# EAGLE design fb_DEV_1_lagig (EAGLE 5.04)
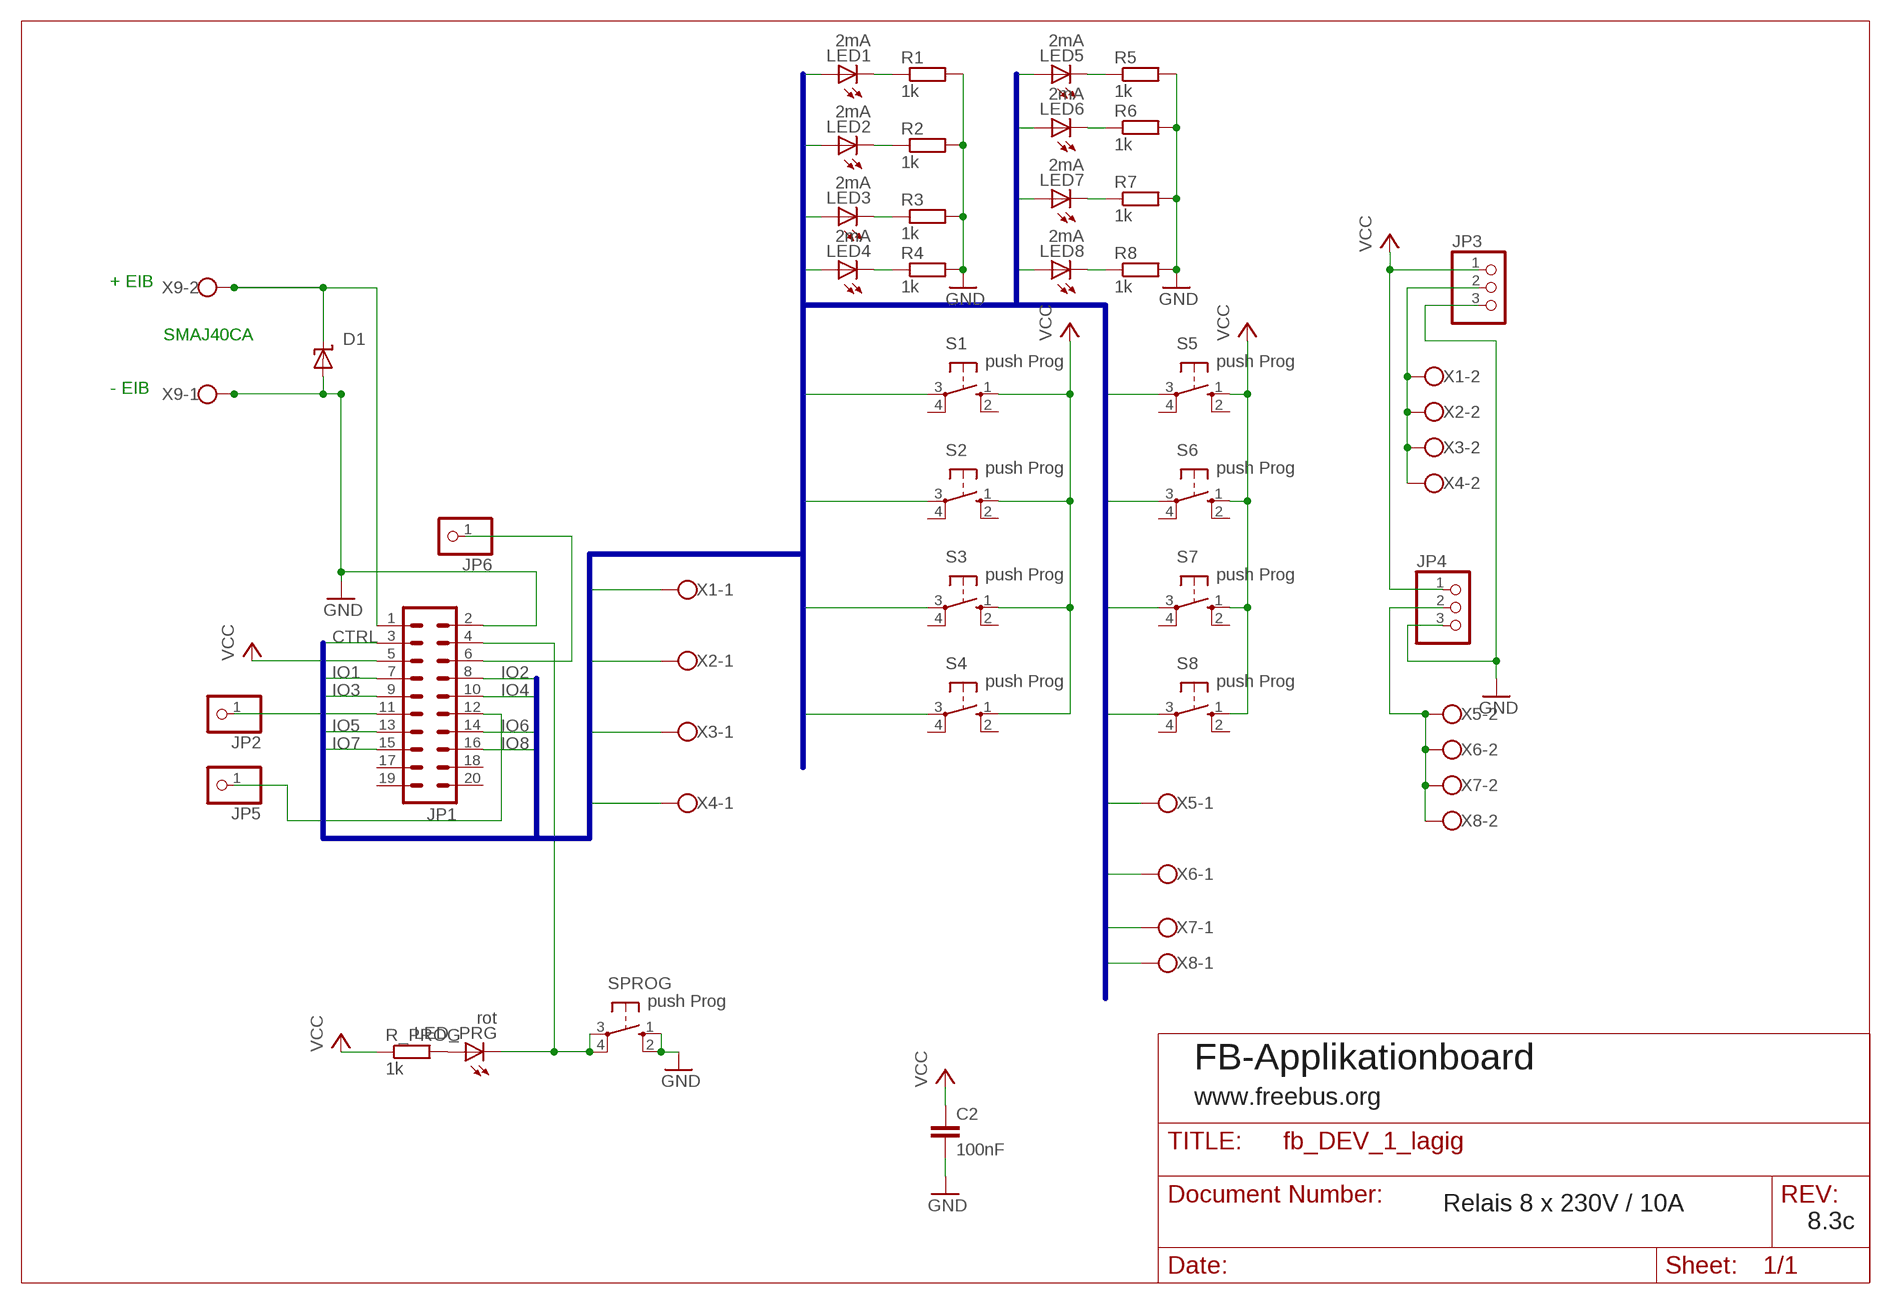
[diagram p0: schematic, sheet 1]

## Parts
C2  100nF  C-EU050-024X044  [C050-024X044]
D1  SUPPRESSOR-SMBJ  [SMBJ]
JP1  ML20  [ML20]
JP2  PINHD-1X1  [1X01]
JP3  PINHD-1X3  [1X03]
JP4  PINHD-1X3  [1X03]
JP5  PINHD-1X1  [1X01]
JP6  PINHD-1X1  [1X01]
LED1  2mA  LED3MM  [LED3MM]
LED2  2mA  LED3MM  [LED3MM]
LED3  2mA  LED3MM  [LED3MM]
LED4  2mA  LED3MM  [LED3MM]
LED5  2mA  LED3MM  [LED3MM]
LED6  2mA  LED3MM  [LED3MM]
LED7  2mA  LED3MM  [LED3MM]
LED8  2mA  LED3MM  [LED3MM]
LED_PRG  rot  LED3MM  [LED3MM]
R1  1k  R-EU_0207/10  [0207/10]
R2  1k  R-EU_0207/10  [0207/10]
R3  1k  R-EU_0207/10  [0207/10]
R4  1k  R-EU_0207/10  [0207/10]
R5  1k  R-EU_0207/10  [0207/10]
R6  1k  R-EU_0207/10  [0207/10]
R7  1k  R-EU_0207/10  [0207/10]
R8  1k  R-EU_0207/10  [0207/10]
R_PROG  1k  R-EU_0207/10  [0207/10]
S1  push Prog  10-XX  [B3F-10XX]
S2  push Prog  10-XX  [B3F-10XX]
S3  push Prog  10-XX  [B3F-10XX]
S4  push Prog  10-XX  [B3F-10XX]
S5  push Prog  10-XX  [B3F-10XX]
S6  push Prog  10-XX  [B3F-10XX]
S7  push Prog  10-XX  [B3F-10XX]
S8  push Prog  10-XX  [B3F-10XX]
SPROG  push Prog  10-XX  [B3F-10XX]
X1  W237-102  [W237-102]
X2  W237-102  [W237-102]
X3  W237-102  [W237-102]
X4  W237-102  [W237-102]
X5  W237-102  [W237-102]
X6  W237-102  [W237-102]
X7  W237-102  [W237-102]
X8  W237-102  [W237-102]
X9  W237-102  [W237-102]

## Nets
CTRL: JP1.3
GND: C2.2 D1.A JP1.2 JP3.3 JP4.3 R1.2 R2.2 R3.2 R4.2 R5.2 R6.2 R7.2 R8.2 SPROG.1(S) SPROG.2(S1) X9.1
IO1: JP1.7 LED1.A S1.3(P) X1.1
IO2: JP1.8 LED2.A S2.3(P) X2.1
IO3: JP1.9 LED3.A S3.3(P) X3.1
IO4: JP1.10 LED4.A S4.3(P) X4.1
IO5: JP1.13 LED5.A S5.3(P) X5.1
IO6: JP1.14 LED6.A S6.3(P) X6.1
IO7: JP1.15 LED7.A S7.3(P) X7.1
IO8: JP1.16 LED8.A S8.3(P) X8.1
N$1: JP4.2 X5.2 X6.2 X7.2 X8.2
N$2: JP3.2 X1.2 X2.2 X3.2 X4.2
N$3: LED1.K(C) R1.1
N$4: LED2.K(C) R2.1
N$5: LED3.K(C) R3.1
N$6: LED4.K(C) R4.1
N$7: JP1.11 JP2.1
N$8: JP1.12 JP5.1
N$9: LED5.K(C) R5.1
N$11: LED6.K(C) R6.1
N$12: LED7.K(C) R7.1
N$13: LED8.K(C) R8.1
N$20: D1.C JP1.1 X9.2
N$24: JP1.6 JP6.1
N$27: JP1.4 LED_PRG.K(C) SPROG.3(P) SPROG.4(P1)
N$28: LED_PRG.A R_PROG.2
VCC: C2.1 JP1.5 JP3.1 JP4.1 R_PROG.1 S1.1(S) S2.1(S) S3.1(S) S4.1(S) S5.1(S) S6.1(S) S7.1(S) S8.1(S)
Unconnected: JP1.17 JP1.18 JP1.19 JP1.20 S1.2(S1) S1.4(P1) S2.2(S1) S2.4(P1) S3.2(S1) S3.4(P1) S4.2(S1) S4.4(P1) S5.2(S1) S5.4(P1) S6.2(S1) S6.4(P1) S7.2(S1) S7.4(P1) S8.2(S1) S8.4(P1)

## Buses
IO[1..8],CTRL

## Notes on the sheet
- + EIB
- SMAJ40CA
- - EIB
- FB-Applikationboard
- www.freebus.org
- Relais 8 x 230V / 10A
- 8.3c

## Library data of the parts
C2 = rcl:C-EU: CAPACITOR, European symbol
D1 = diode:SUPPRESSOR-: Suppressor diode
JP1 = con-harting-ml:ML20: HARTING
JP2 JP5 JP6 = pinhead:PINHD-1X1: PIN HEADER
JP3 JP4 = pinhead:PINHD-1X3: PIN HEADER
LED1-LED8 LED_PRG = led:LED: LED OSRAM: - CHIPLED LG R971, LG N971, LY N971, LG Q971, LY Q971, LO R971, LY R971 LH N974, LH R974 LS Q976, LO Q976, LY Q976 LO Q996 - Hyper CHIPLED LW Q18S LB Q993, LB Q99A, LB R99A - SideLED LS A670, LO A670, LY A670, LG A670, LP A670 LB A673, LV A673, LT A673, LW A673 LH A674 LY A675 LS A676, LA A676, LO A676, LY A676, LW A676 LS A679, LY A679, LG A679 - Hyper Micro SIDELED® LS Y876, LA Y876, LO Y876, LY Y876 LT Y87S - SmartLED LW L88C, LW L88S LB L89C, LB L89S, LG L890 LS L89K, LO L89K, LY L89K LS L896, LA L896, LO L896, LY L896 - TOPLED LS T670, LO T670, LY T670, LG T670, LP T670 LSG T670, LSP T670, LSY T670, LOP T670, LYG T670 LG T671, LOG T671, LSG T671 LB T673, LV T673, LT T673, LW T673 LH T674 LS T676, LA T676, LO T676, LY T676, LB T676, LH T676, LSB T676, LW T676 LB T67C, LV T67C, LT T67C, LS T67K, LO T67K, LY T67K, LW E67C LS E67B, LA E67B, LO E67B, LY E67B, LB E67C, LV E67C, LT E67C LW T67C LS T679, LY T679, LG T679 LS T770, LO T770, LY T770, LG T770, LP T770 LB T773, LV T773, LT T773, LW T773 LH T774 LS E675, LA E675, LY E675, LS T675 LS T776, LA T776, LO T776, LY T776, LB T776 LHGB T686 LT T68C, LB T68C - Hyper Mini TOPLED® LB M676 - Mini TOPLED Santana® LG M470 LS M47K, LO M47K, LY M47K Source: http://www.osram.convergy.de - LUMILED® LXK2-PW12-R00, LXK2-PW12-S00, LXK2-PW14-U00, LXK2-PW14-V00 LXK2-PM12-R00, LXK2-PM12-S00, LXK2-PM14-U00 LXK2-PE12-Q00, LXK2-PE12-R00, LXK2-PE12-S00, LXK2-PE14-T00, LXK2-PE14-U00 LXK2-PB12-K00, LXK2-PB12-L00, LXK2-PB12-M00, LXK2-PB14-N00, LXK2-PB14-P00, LXK2-PB14-Q00 LXK2-PR12-L00, LXK2-PR12-M00, LXK2-PR14-Q00, LXK2-PR14-R00 LXK2-PD12-Q00, LXK2-PD12-R00, LXK2-PD12-S00 LXK2-PH12-R00, LXK2-PH12-S00 LXK2-PL12-P00, LXK2-PL12-Q00, LXK2-PL12-R00 Source: www.luxeon.com
R1-R8 R_PROG = rcl:R-EU_: RESISTOR, European symbol
S1-S8 SPROG = switch-omron:10-XX: OMRON SWITCH
X1-X9 = con-wago-500:W237-102: WAGO SCREW CLAMP

## Net classes
0 SELV: width 0.406 mm
1 230Vac: width 1.93 mm, clearance 5.08 mm to class 0, clearance 1.905 mm

## Board
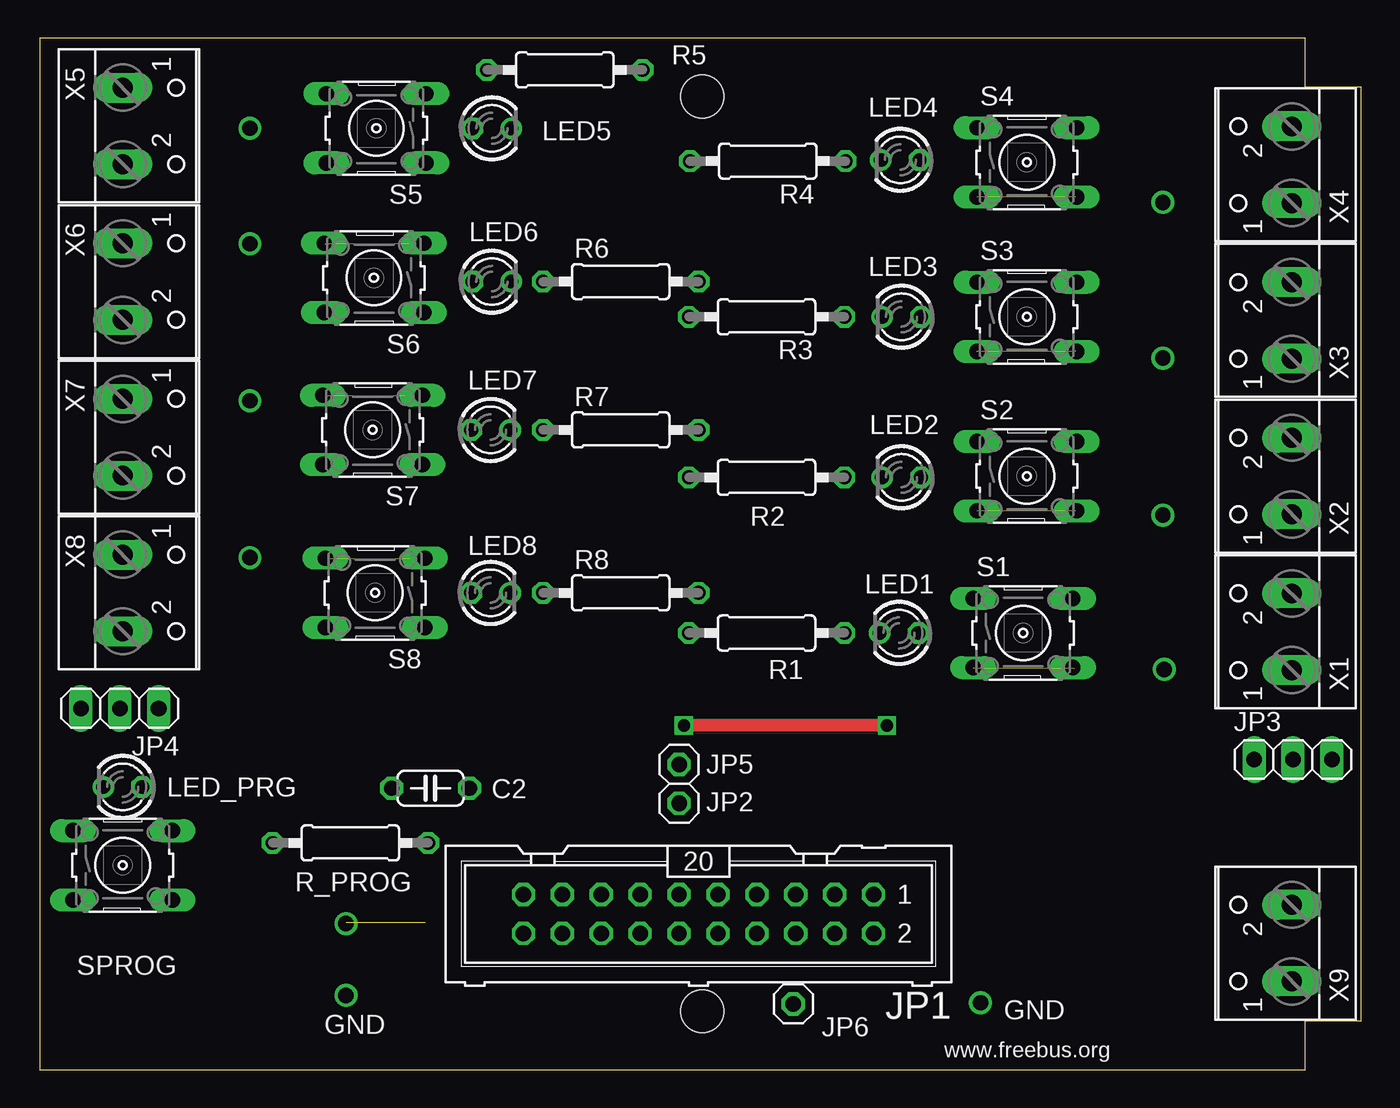
[diagram p1: board, top side]
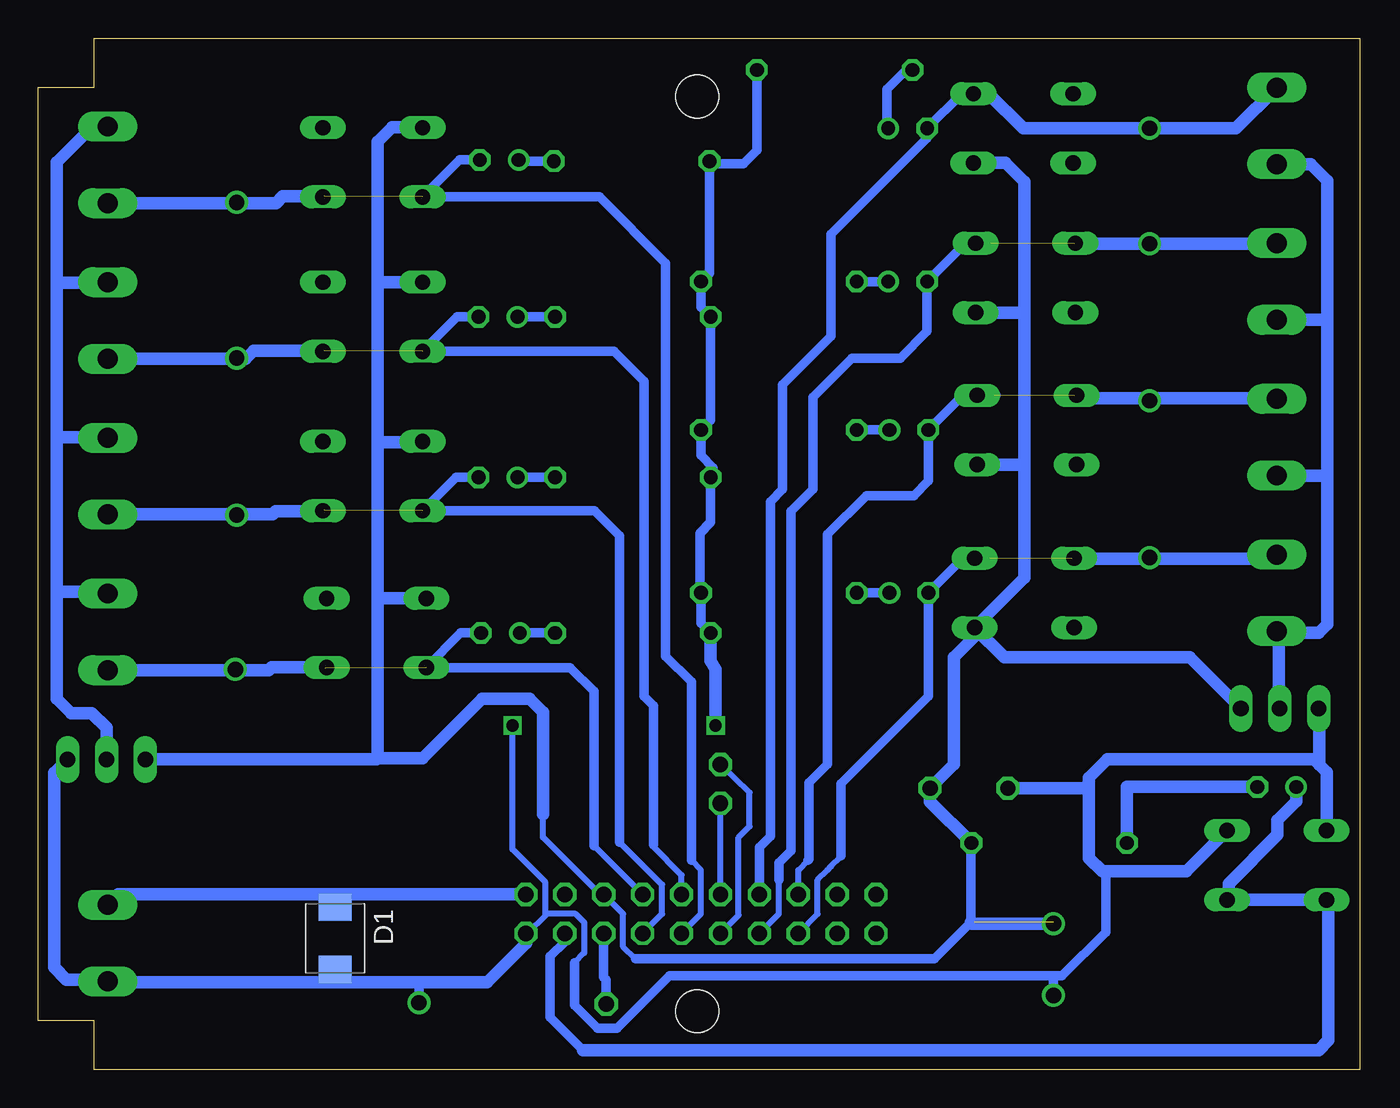
[diagram p2: board, bottom side, seen from below]

Size 86.28 x 67.31 mm. Coordinates in mm from the lower left corner, seen from the top.
Outline: 0,0.01 82.64,0 82.64,3.18 86.28,3.18 86.28,64.13 82.64,64.13 82.64,67.31 0,67.31 0,0.01
Copper layers (1*16): Top 0.035mm / dielectric 1.5mm / Bottom 0.035mm
Design rules "0.35mm": minimum track width 10mil, minimum drill 24mil, track to track 0.35mm, track to pad 0.35mm, pad to pad 0.35mm, via to via 0.35mm, smd to smd 0.35mm, copper to edge 0mil, drill to drill 8mil, minimum pad ring 10mil, minimum via ring 8mil, stop-mask expansion 4mil, vias tented up to drill 0mil, thermal gap 10mil
Holes 2.8 mm at 43.27,3.81 43.27,63.5

### Footprints (pad centres in the part's own frame; a part is rotated, then mirrored left to right if it is on the bottom)
C050-024X044 = drill 1 octagon: 1 -2.54,0; 2 2.54,0
SMBJ = smd 1.78 x 2.16: A 2.04,0; C -2.03,0
ML20 = drill 1 octagon: 1 -11.43,-1.27; 2 -11.43,1.27; 3 -8.89,-1.27; 4 -8.89,1.27; 5 -6.35,-1.27; 6 -6.35,1.27; 7 -3.81,-1.27; 8 -3.81,1.27; 9 -1.27,-1.27; 10 -1.27,1.27; 11 1.27,-1.27; 12 1.27,1.27; 13 3.81,-1.27; 14 3.81,1.27; 15 6.35,-1.27; 16 6.35,1.27; 17 8.89,-1.27; 18 8.89,1.27; 19 11.43,-1.27; 20 11.43,1.27
1X01 = drill 1.016 octagon: 1 0,0
1X03 = drill 1.016 long: 1 -2.54,0; 2 0,0; 3 2.54,0
LED3MM = drill 0.9 octagon: A -1.27,0 | drill 0.9 round: K 1.27,0
0207/10 = drill 0.9 octagon: 1 -5.08,0; 2 5.08,0
B3F-10XX = drill 1 long: 1 -3.251,2.261; 2 3.251,2.261; 3 -3.251,-2.261; 4 3.251,-2.261
W237-102 = drill 1.3 long: 1 -2.5,-1.27; 2 2.5,-1.27

### Placement (x,y rotation side)
C2  25.52,18.37 180 top
D1  66.91,8.57 270 bottom
JP1  43.01,10.16 180 top
JP2  41.74,17.38 0 top
JP3  81.83,20.24 0 top
JP4  5.23,23.57 180 top
JP5  41.75,19.92 0 top
JP6  49.21,4.29 0 top
LED1  56.11,28.5 180 top
LED2  56.27,38.66 180 top
LED3  56.27,49.13 180 top
LED4  56.19,59.37 180 top
LED5  29.52,61.44 0 top
LED6  29.52,51.44 0 top
LED7  29.44,41.75 0 top
LED8  29.44,31.11 0 top
LED_PRG  5.42,18.45 180 top
R1  47.46,28.5 180 top
R2  47.46,38.66 180 top
R3  47.46,49.13 180 top
R4  47.54,59.29 180 top
R5  34.28,65.25 0 top
R6  37.93,51.44 0 top
R7  37.93,41.75 0 top
R8  37.93,31.12 0 top
R_PROG  20.28,14.8 180 top
S1  64.21,28.5 0 top
S2  64.45,38.73 0 top
S3  64.45,49.13 0 top
S4  64.45,59.21 0 top
S5  21.98,61.44 180 top
S6  21.82,51.67 180 top
S7  21.74,41.75 180 top
S8  21.9,31.11 180 top
SPROG  5.42,13.34 0 top
X1  80.48,28.57 90 top
X2  80.48,38.73 90 top
X3  80.48,48.9 90 top
X4  80.48,59.05 90 top
X5  6.69,61.59 270 top
X6  6.69,51.44 270 top
X7  6.69,41.27 270 top
X8  6.69,31.11 270 top
X9  80.48,8.26 90 top

### Tracks (layer width: path | path; a pad name or v marks a point on that pad's centre or on a via)
GND  (via drill 0.8, 1)
  Top 0.813: v55.32,22.46 v42.06,22.46
  Bottom 0.406: JP1.2 54.37,8.89 53.17,10.08 | 53.17,10.08 53.17,12.22 55.32,14.37 v55.32,22.46 | 16.42,12.94 16.58,12.78 | 53.17,10.08 53.1,10.16 51.19,10.16 50.63,9.6 50.63,7.62 51.27,6.99
  Bottom 0.61: R5.2 39.36,60.01 40.24,59.13 42.3,59.13 R4.2 42.46,51.99 R6.2 43.01,49.77 R3.2 42.38,42.39 R7.2 43.01,40.08 42.22,39.29 42.22,38.81 R2.2 42.38,35.72 43.09,35 43.09,31.2 R8.2 43.01,29.13 R1.2 | 19.92,6.11 19.44,6.11 16.58,8.97 16.58,12.78 | 19.92,6.11 45.08,6.11 48.49,2.7 49.76,2.7 51.27,4.21 51.27,6.99 | v61.43,4.37 61.43,5.64 61.51,5.71 | v20,4.84 20,6.03 19.92,6.11
  Bottom 0.813: JP1.2 54.44,8.26 56.98,5.71 61.51,5.71 66.75,5.71 | 66.75,5.71 81.71,5.71 X9.1 81.87,5.87 84.45,5.87 85.24,6.67 85.24,19.37 JP3.3 | D1.A 66.91,5.87 66.75,5.71 | SPROG.1 2.17,19.4 2.65,19.88 | 2.65,19.88 3.01,20.24 16.48,20.24 17.68,19.04 17.68,18.65 | SPROG.2 11.33,12.94 16.42,12.94 16.82,12.94 17.68,13.8 17.68,18.65 | JP4.3 2.65,23.54 2.65,19.88 | C2.2 17.97,18.37 17.68,18.65 | R1.2 42.38,26.67 42.06,26.11 42.06,24.77 v42.06,22.46
IO1  (1 unrouted)
  Bottom 0.406: JP1.7 50,14.61
  Bottom 0.61: LED1.A 58.7,28.5 S1.3 51.55,26.23 50,24.69 50,14.61
  Bottom 0.813: X1.1 71.23,26.07 71.03,26.27 67.62,26.27 67.54,26.19
IO2  (1 unrouted)
  Bottom 0.406: JP1.8 45.55,10.16 45.55,12.06 47.46,13.97 47.62,14.13 48.33,14.84
  Bottom 0.61: LED2.A 59.01,38.66 S2.3 49.96,36.47 48.33,34.85 48.33,14.84
  Bottom 0.813: X2.1 70.99,36.23 70.8,36.43 67.7,36.43 67.62,36.51
IO3  (1 unrouted)
  Bottom 0.406: JP1.9 44.28,12.7 46.19,14.61 46.11,14.68
  Bottom 0.61: LED3.A 58.93,49.13 S3.3 48.69,46.87 46.75,44.93 46.75,24.37 46.11,23.73 46.11,14.68
  Bottom 0.813: X3.1 72.74,46.4 72.22,46.91 67.62,46.91
IO4  (1 unrouted)
  Bottom 0.406: JP1.10 43.01,10.16 43.01,13.02 43.65,13.65
  Bottom 0.61: LED4.A 58.78,59.37 S4.3 49.64,56.95 45.32,52.63 45.32,26.99 43.65,25.32 43.65,13.65
  Bottom 0.813: X4.1 70.76,56.55 70.32,56.99 67.62,56.99
IO5  (via drill 1)
  Bottom 0.406: JP1.13 39.2,12.06
  Bottom 0.61: S5.3 25.99,63.7 LED5.A 28.25,60.8 34.52,54.53 34.52,47.86 37.7,44.69 37.7,37.86 38.49,37.07 38.49,15.24 39.2,14.53 39.2,12.06
  Bottom 0.813: X5.1 8.08,61.44 v13.73,61.44 21.98,61.44 24.24,63.7 S5.3
IO6  (via drill 1)  (1 unrouted)
  Bottom 0.406: JP1.14 37.93,10.16 37.93,12.38
  Bottom 0.61: S6.3 25.75,53.93 LED6.A 28.25,48.18 30,46.43 33.17,46.43 35.71,43.89 35.71,37.86 37.14,36.43 37.14,14.29 37.93,13.49 37.93,12.38
  Bottom 0.813: S6.3 24.08,53.93 | X6.1 5.46,53.9 v13.73,53.9 18.65,53.9
IO7  (1 unrouted)
  Bottom 0.406: JP1.15 36.66,13.02 36.03,13.65
  Bottom 0.61: S7.3 25.91,44.01 LED7.A 28.17,38.42 29.12,37.47 32.22,37.47 34.76,34.92 34.76,19.92 35.95,18.73 35.95,13.73 36.03,13.65
  Bottom 0.813: S7.3 23.84,44.01 | X7.1 5.46,43.81 18.49,43.81 18.65,43.97
IO8  (1 unrouted)
  Bottom 0.406: JP1.16 35.39,10.16 35.39,12.38 34.76,13.02 34.52,13.26 33.89,13.89 33.89,13.97
  Bottom 0.61: S8.3 25.91,33.38 LED8.A 28.17,24.37 33.89,18.65 33.89,13.97
  Bottom 0.813: S8.3 24.16,33.38 | X8.1 5.7,33.34 18.81,33.34
N$1
  Bottom 0.813: X5.2 3.21,59.09 2.14,58.02 2.14,48.97 | 2.14,38.73 2.14,29.05 2.69,28.5 5.3,28.5 | 2.14,38.73 2.14,48.97 | 5.3,28.5 X8.2 | 5.3,28.5 5.3,23.64 JP4.2 | X6.2 2.18,48.94 2.14,48.97 | X7.2 2.18,38.77 2.14,38.73
N$2
  Bottom 0.813: JP3.2 81.83,22.3 82.78,23.26 84.13,23.26 85.08,24.21 85.08,31.19 | 85.08,31.19 85.08,41.27 | 85.08,41.27 85.08,51.36 | 85.08,51.36 85.08,59.21 82.74,61.55 X4.2 | X3.2 81.79,51.36 85.08,51.36 | X2.2 81.79,41.27 85.08,41.27 | X1.2 81.87,31.19 85.08,31.19
N$3
  Bottom 0.61: R1.1 LED1.K
N$4
  Bottom 0.61: R2.1 LED2.K
N$5
  Bottom 0.61: R3.1 LED3.K
N$6
  Bottom 0.61: R4.1 54.84,59.29 LED4.K
N$7
  Bottom 0.406: JP1.11 41.74,16.11 JP2.1
N$8
  Bottom 0.406: JP1.12 | JP1.12 40.55,10.08 40.55,15.16 39.84,15.88 39.84,18.1 JP5.1
N$9
  Bottom 0.61: R5.1 29.6,65.25 30.87,63.98 30.87,61.52 LED5.K
N$10  (via drill 1)
  other vias: 13.73,43.66
N$11
  Bottom 0.61: R6.1 LED6.K
N$12
  Bottom 0.61: R7.1 LED7.K | LED7.K
N$13
  Bottom 0.61: R8.1 LED8.K | LED8.K
N$14  (via drill 1)
  other vias: 13.73,33.42
N$15  (via drill 1)
  other vias: 73.34,56.59
N$16  (via drill 1)
  other vias: 73.34,46.43
N$17  (via drill 1)
  other vias: 73.34,36.2
N$19  (via drill 1)
  other vias: 73.42,26.11
N$20
  Bottom 0.813: JP1.1 66.99,11.43 | 66.99,11.43 81.07,11.43 X9.2 | D1.C 66.91,11.35 66.99,11.43
N$24
  Bottom 0.61: JP1.6 49.36,6.03 49.21,5.87 JP6.1
N$27
  Bottom 0.61: JP1.4 51.9,8.33 52.86,7.38 52.86,3.41 50.71,1.27
  Bottom 0.813: LED_PRG.K 4.15,17.51 5.39,16.27 5.39,15.32 8.57,12.14 8.57,11.18 SPROG.4 SPROG.3 2.06,10.96 2.06,1.91 2.69,1.27 50.71,1.27
N$28
  Bottom 0.406: R_PROG.2 15.23,14.76 | R_PROG.2
  Bottom 0.813: LED_PRG.A 15.2,18.45 R_PROG.2
N$29  (1 unrouted)
VCC  (via drill 1)
  Bottom 0.406: 53.33,16.83 53.33,15.16 49.6,11.43 JP1.5 48.09,10.16 48.09,8.02 47.3,7.22 | R_PROG.1 25.39,14.76
  Bottom 0.61: 47.3,7.22 27.77,7.22 25.39,9.6 25.39,14.76 | 21.9,39.37 22.02,39.49 | 21.9,49.45 21.94,49.41
  Bottom 0.813: JP4.1 11.11,26.91 23.21,26.91 S8.1 | 25.63,15.06 R_PROG.1 28.06,17.49 C2.1 26.5,19.92 26.5,26.91 25.08,28.34 25.08,28.78 S8.1 | 61.19,61.43 S4.1 61.24,61.52 63.18,61.52 64.13,60.56 64.13,51.44 | 61.19,51.11 S3.1 64.09,51.4 64.13,51.44 | 61.27,41.07 S2.1 61.19,40.95 63.89,40.95 64.13,40.72 | S1.1 61.27,31.07 | S1.1 61.23,30.76 | 64.13,20.32 64.21,20.24 JP3.1 | JP3.1 | 53.33,16.67 53.33,16.83 53.33,23.34 54.21,24.21 57.3,24.21 61.19,20.32 64.13,20.32 | S5.1 23.13,59.18 21.9,57.94 21.9,49.45 21.9,39.37 21.9,32.11 S8.1 | 22.02,39.49 S7.1 | 21.94,49.41 S6.1 | 64.13,20.32 64.13,30.64 | 64.13,30.64 64.13,40.72 | 64.13,40.72 64.13,51.44 | S1.1 64.01,30.76 64.13,30.64 | v20,9.53 25.31,9.53 25.39,9.6

### Text on the board
tNames: GND | GND | www.freebus.org
tValues: SCLK | SDA | 28V-
Document: EIB + | EIB -